# EAGLE board TP-34 (EAGLE 6.6.0), part 1 of 2
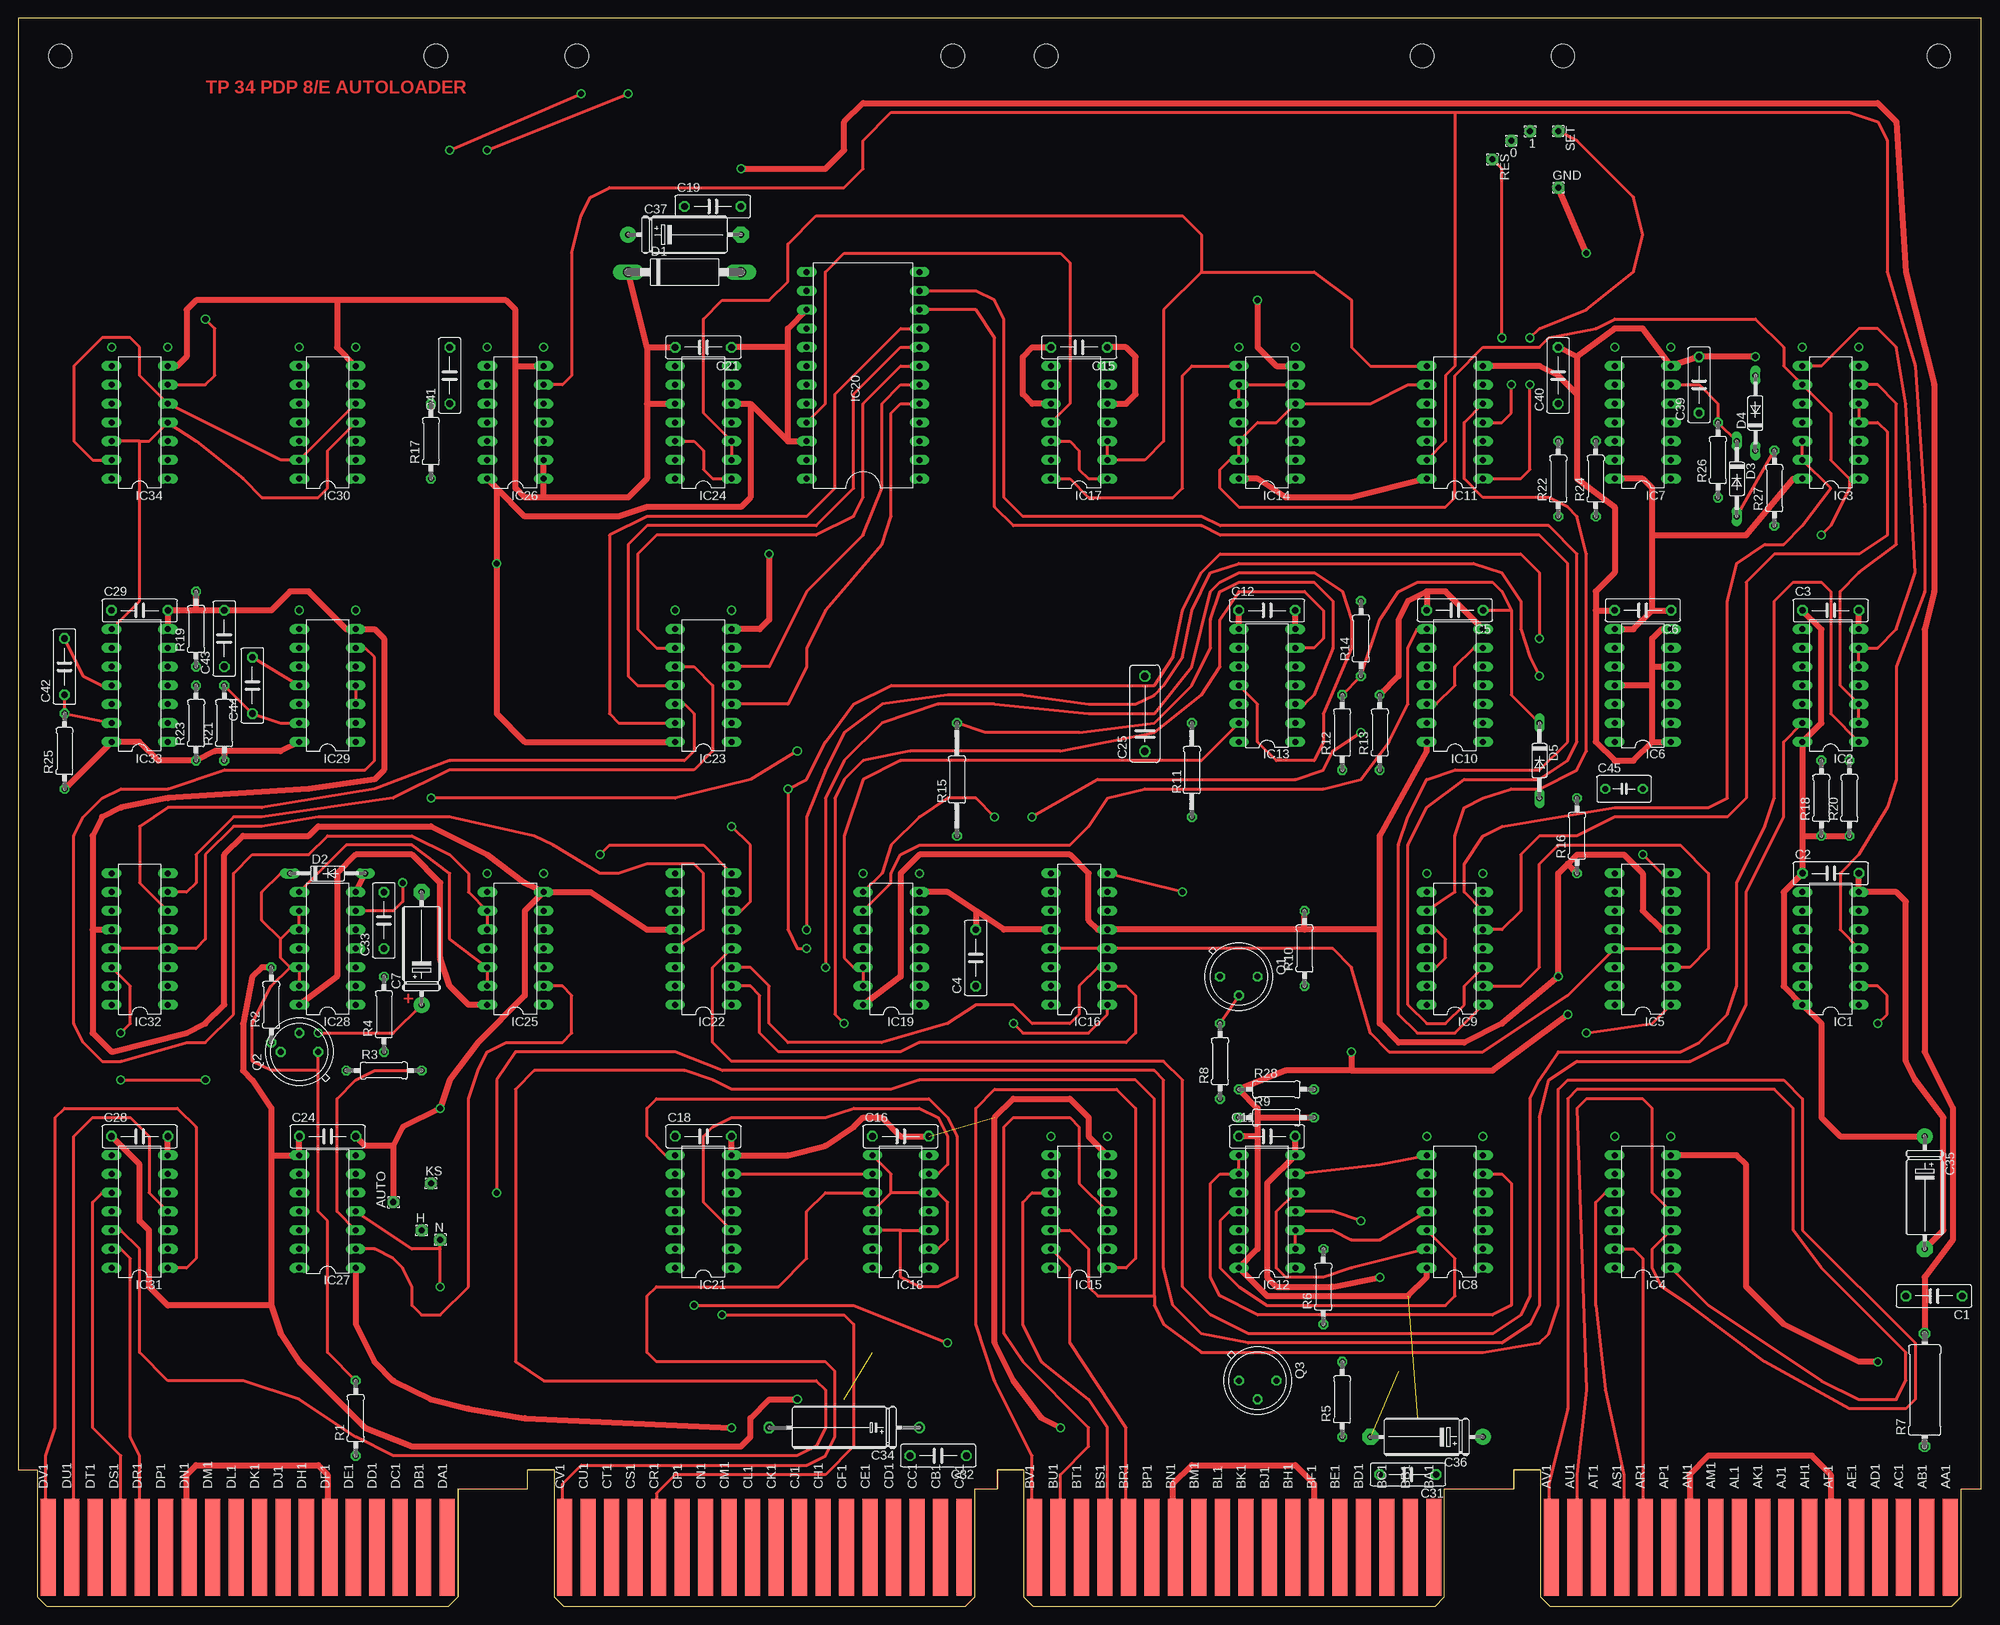
[diagram p4: board, top side]
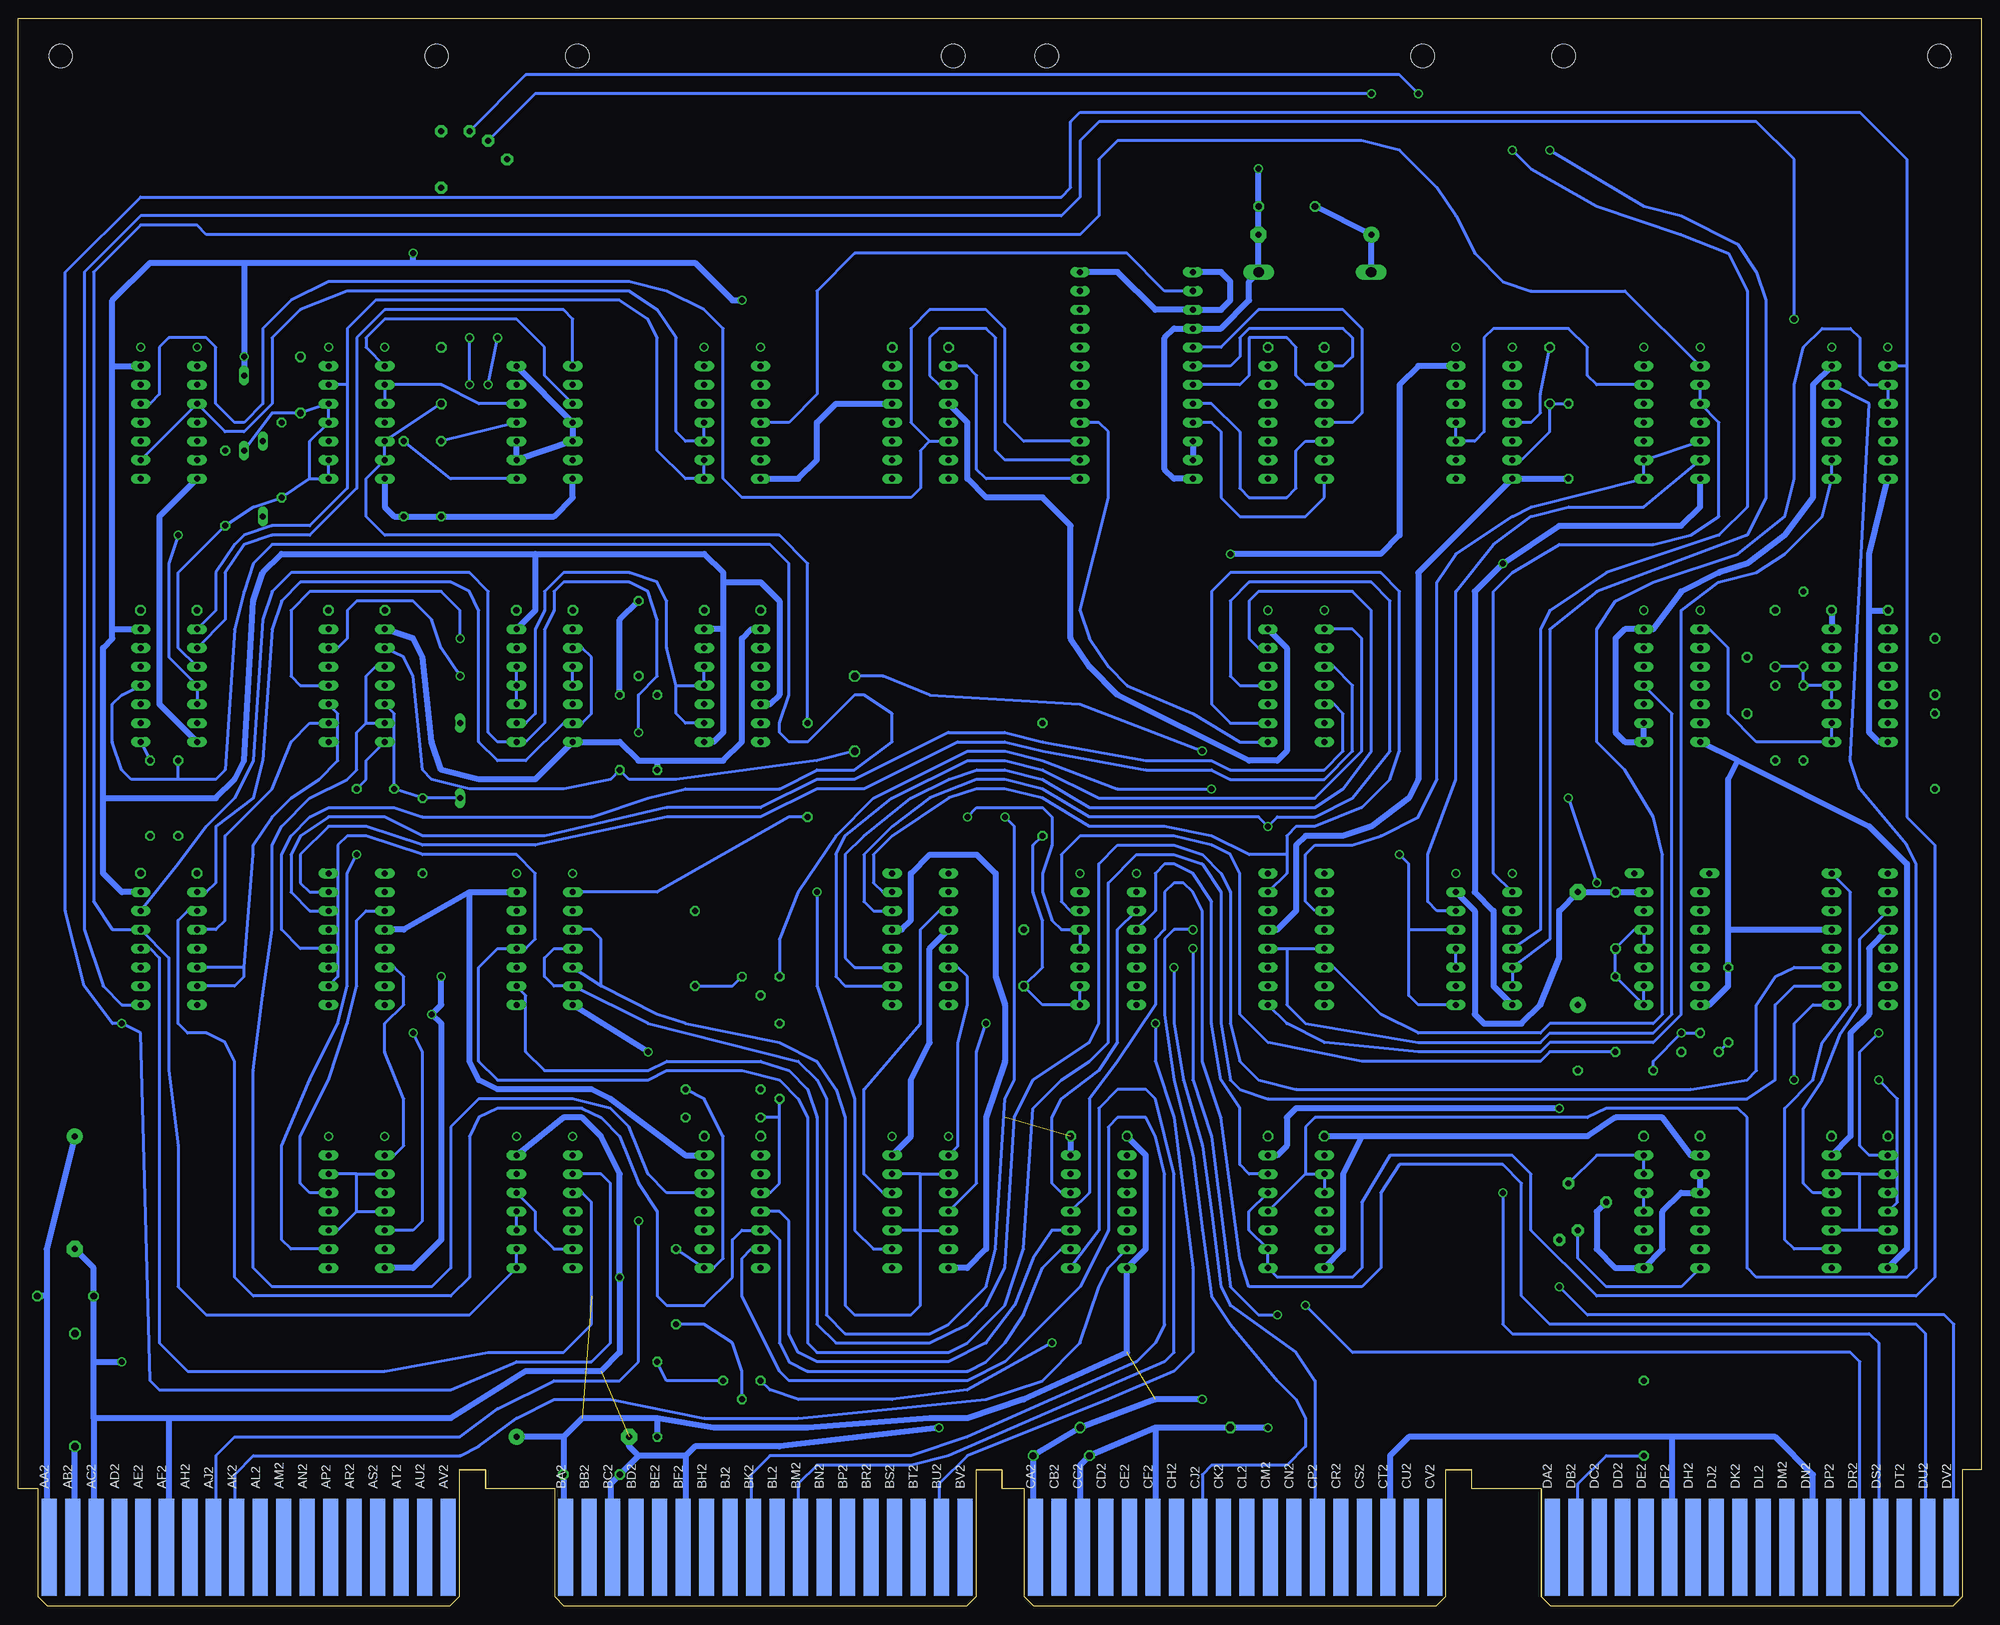
[diagram p5: board, bottom side, seen from below]

Size 265.3 x 214.63 mm. Coordinates in mm from the lower left corner, seen from the top.
Copper layers (1+16): Top 0.035mm / dielectric 1.5mm / Bottom 0.035mm
Design rules "16mils": minimum track width 16mil, minimum drill 32mil, track to track 15mil, track to pad 10mil, pad to pad 10mil, via to via 10mil, smd to smd 10mil, copper to edge 13mil, drill to drill 10mil, minimum pad ring 10mil, minimum via ring 8mil, stop-mask expansion 0mil, vias tented up to drill 0mil, thermal gap 10mil
Net classes: 1 supply: width 0.813 mm

## Footprints (pad centres in the part's own frame; a part is rotated, then mirrored left to right if it is on the bottom)
1,6/0,8 = drill 0.813 pad 1.6 octagon: 1 0,0
C075-032X103 = drill 0.914 octagon: 1 -3.81,0; 2 3.81,0
E15-5 = drill 0.813 pad 2.159: + -7.62,0 | drill 0.813 pad 2.159 octagon: - 7.62,0
C102-043X133 = drill 1.016 octagon: 1 -5.08,0; 2 5.08,0
E12-8 = drill 1.016: + -10.16,0 | drill 1.016 octagon: - 10.16,0
C050-035X075 = drill 0.813 octagon: 1 -2.54,0; 2 2.54,0
C1702-15 = drill 1.397 long: A 7.62,0; C -7.62,0
DO35-10 = drill 0.813 long: A 5.08,0; C -5.08,0
DIL14 = drill 0.813 long: 1 -7.62,-3.81; 2 -5.08,-3.81; 3 -2.54,-3.81; 4 0,-3.81; 5 2.54,-3.81; 6 5.08,-3.81; 7 7.62,-3.81; 8 7.62,3.81; 9 5.08,3.81; 10 2.54,3.81; 11 0,3.81; 12 -2.54,3.81; 13 -5.08,3.81; 14 -7.62,3.81
DIL16 = drill 0.813 long: 1 -8.89,-3.81; 2 -6.35,-3.81; 3 -3.81,-3.81; 4 -1.27,-3.81; 5 1.27,-3.81; 6 3.81,-3.81; 7 6.35,-3.81; 8 8.89,-3.81; 9 8.89,3.81; 10 6.35,3.81; 11 3.81,3.81; 12 1.27,3.81; 13 -1.27,3.81; 14 -3.81,3.81; 15 -6.35,3.81; 16 -8.89,3.81
DIL24 = drill 0.813 long: 1 -12.7,-7.62; 2 -10.16,-7.62; 3 -7.62,-7.62; 4 -5.08,-7.62; 5 -2.54,-7.62; 6 0,-7.62; 7 2.54,-7.62; 8 5.08,-7.62; 9 7.62,-7.62; 10 10.16,-7.62; 11 12.7,-7.62; 12 15.24,-7.62; 13 15.24,7.62; 14 12.7,7.62; 15 10.16,7.62; 16 7.62,7.62; 17 5.08,7.62; 18 2.54,7.62; 19 0,7.62; 20 -2.54,7.62; 21 -5.08,7.62; 22 -7.62,7.62; 23 -10.16,7.62; 24 -12.7,7.62
TO5 = drill 0.813 octagon: 1 0,-2.54; 2 2.54,0; 3 0,2.54
0207/10 = drill 0.813 octagon: 1 -5.08,0; 2 5.08,0
0414/15 = drill 1.016 octagon: 1 -7.62,0; 2 7.62,0
0207/12 = drill 0.813 octagon: 1 -6.35,0; 2 6.35,0
0207/15 = drill 0.813 octagon: 1 -7.62,0; 2 7.62,0
OMNIBUS = hole 3.175: 208.915,209.55; 259.715,209.55; 189.865,209.55; 139.065,209.55; 75.616,209.55; 126.416,209.55; 56.566,209.55; 5.766,209.55
EDGE-CON8 = smd 2.032 x 13.106: AA1 261.303,7.938; AB1 258.127,7.938; AC1 254.952,7.938; AD1 251.778,7.938; AE1 248.602,7.938; AF1 245.428,7.938; AH1 242.252,7.938; AJ1 239.077,7.938; AK1 235.903,7.938; AL1 232.727,7.938; AM1 229.553,7.938; AN1 226.377,7.938; AP1 223.202,7.938; AR1 220.028,7.938; AS1 216.852,7.938; AT1 213.678,7.938; AU1 210.502,7.938; AV1 207.327,7.938; BA1 191.452,7.938; BB1 188.278,7.938; BC1 185.102,7.938; BD1 181.928,7.938; BE1 178.752,7.938; BF1 175.577,7.938; BH1 172.403,7.938; BJ1 169.227,7.938; BK1 166.053,7.938; BL1 162.877,7.938; BM1 159.702,7.938; BN1 156.528,7.938; BP1 153.352,7.938; BR1 150.178,7.938; BS1 147.002,7.938; BT1 143.827,7.938; BU1 140.653,7.938; BV1 137.477,7.938; CA1 127.953,7.938; CB1 124.778,7.938; CC1 121.603,7.938; CD1 118.427,7.938; CE1 115.252,7.938; CF1 112.078,7.938; CH1 108.903,7.938; CJ1 105.728,7.938; CK1 102.552,7.938; CL1 99.377,7.938; CM1 96.203,7.938; CN1 93.028,7.938; CP1 89.853,7.938; CR1 86.677,7.938; CS1 83.502,7.938; CT1 80.328,7.938; CU1 77.153,7.938; CV1 73.978,7.938; DA1 58.102,7.938; DB1 54.928,7.938; DC1 51.752,7.938; DD1 48.578,7.938; DE1 45.403,7.938; DF1 42.227,7.938; DH1 39.053,7.938; DJ1 35.877,7.938; DK1 32.703,7.938; DL1 29.527,7.938; DM1 26.352,7.938; DN1 23.177,7.938; DP1 20.003,7.938; DR1 16.828,7.938; DS1 13.652,7.938; DT1 10.477,7.938; DU1 7.303,7.938; DV1 4.128,7.938 | smd 2.032 x 13.106 bottom: AA2 261.303,7.938; AB2 258.127,7.938; AC2 254.952,7.938; AD2 251.778,7.938; AE2 248.602,7.938; AF2 245.428,7.938; AH2 242.252,7.938; AJ2 239.077,7.938; AK2 235.903,7.938; AL2 232.727,7.938; AM2 229.553,7.938; AN2 226.377,7.938; AP2 223.202,7.938; AR2 220.028,7.938; AS2 216.852,7.938; AT2 213.678,7.938; AU2 210.502,7.938; AV2 207.327,7.938; BA2 191.452,7.938; BB2 188.278,7.938; BC2 185.102,7.938; BD2 181.928,7.938; BE2 178.752,7.938; BF2 175.577,7.938; BH2 172.403,7.938; BJ2 169.227,7.938; BK2 166.053,7.938; BL2 162.877,7.938; BM2 159.702,7.938; BN2 156.528,7.938; BP2 153.352,7.938; BR2 150.178,7.938; BS2 147.002,7.938; BT2 143.827,7.938; BU2 140.653,7.938; BV2 137.477,7.938; CA2 127.953,7.938; CB2 124.778,7.938; CC2 121.603,7.938; CD2 118.427,7.938; CE2 115.252,7.938; CF2 112.078,7.938; CH2 108.903,7.938; CJ2 105.728,7.938; CK2 102.552,7.938; CL2 99.377,7.938; CM2 96.203,7.938; CN2 93.028,7.938; CP2 89.853,7.938; CR2 86.677,7.938; CS2 83.502,7.938; CT2 80.328,7.938; CU2 77.153,7.938; CV2 73.978,7.938; DA2 58.102,7.938; DB2 54.928,7.938; DC2 51.752,7.938; DD2 48.578,7.938; DE2 45.403,7.938; DF2 42.227,7.938; DH2 39.053,7.938; DJ2 35.877,7.938; DK2 32.703,7.938; DL2 29.527,7.938; DM2 26.352,7.938; DN2 23.177,7.938; DP2 20.003,7.938; DR2 16.828,7.938; DS2 13.652,7.938; DT2 10.477,7.938; DU2 7.303,7.938; DV2 4.128,7.938

## Placement (x,y rotation side)
0  [1,6/0,8]  201.8,198.12 180 top
1  [1,6/0,8]  204.34,199.39 180 top
AUTO  [1,6/0,8]  50.67,54.61 90 top
C1  .01uF  [C075-032X103]  258.95,41.91 180 top
C2  .01uF  [C075-032X103]  244.98,99.06 0 top
C3  .01uF  [C075-032X103]  244.98,134.62 0 top
C4  .22uF  [C075-032X103]  129.41,87.63 90 top
C5  .01uF  [C075-032X103]  194.18,134.62 180 top
C6  .01uF  [C075-032X103]  219.58,134.62 180 top
C7  39uF (not installed)  [E15-5]  54.48,88.9 90 top
C11  .01uF  [C075-032X103]  168.78,63.5 0 top
C12  .01uF  [C075-032X103]  168.78,134.62 0 top
C15  .01uF  [C075-032X103]  143.38,170.18 180 top
C16  .01uF  [C075-032X103]  119.25,63.5 0 top
C18  .01uF  [C075-032X103]  92.58,63.5 0 top
C19  .01uF  [C075-032X103]  93.85,189.23 0 top
C21  .01uF  [C075-032X103]  92.58,170.18 180 top
C24  .01uF  [C075-032X103]  41.78,63.5 0 top
C25  56pF  [C102-043X133]  152.27,120.65 90 top
C28  .01uF  [C075-032X103]  16.38,63.5 0 top
C29  .01uF  [C075-032X103]  16.38,134.62 0 top
C31  .01uF  [C075-032X103]  187.83,17.78 180 top
C32  .01uF  [C075-032X103]  124.33,20.32 180 top
C33  .01uF  [C075-032X103]  49.4,92.71 90 top
C34  22uF  [E12-8]  111.63,24.13 180 top
C35  25uF  [E15-5]  257.68,55.88 270 top
C36  25uF  [E15-5]  190.37,22.86 180 top
C37  25uF  [E15-5]  90.04,185.42 0 top
C39  .22uF  [C075-032X103]  227.2,165.1 90 top
C40  .01uF  [C075-032X103]  208.15,166.37 90 top
C41  1nF  [C075-032X103]  58.29,166.37 90 top
C42  1nF  [C075-032X103]  6.22,127 90 top
C43  .01uF  [C075-032X103]  27.81,130.81 90 top
C44  1nF  [C075-032X103]  31.62,124.46 90 top
C45  1nF  [C050-035X075]  217.04,110.49 0 top
D1  10V 1N4739  [C1702-15]  90.04,180.34 0 top
D2  1N4154  [DO35-10]  41.78,99.06 0 top
D3  1N4154  [DO35-10]  232.28,152.4 270 top
D4  1N4154  [DO35-10]  234.82,161.29 90 top
D5  1N4154  [DO35-10]  205.61,114.3 270 top
GND  [1,6/0,8]  208.15,191.77 0 top
H  [1,6/0,8]  54.48,50.8 0 top
IC1  7420N  [DIL14]  244.98,88.9 90 top
IC2  7401N  [DIL14]  244.98,124.46 90 top
IC3  7420N  [DIL14]  244.98,160.02 90 top
IC4  7401N  [DIL14]  219.58,53.34 90 top
IC5  7475N  [DIL16]  219.58,90.17 90 top
IC6  SP380N  [DIL14]  219.58,124.46 90 top
IC7  7413N  [DIL14]  219.58,160.02 90 top
IC8  7400N  [DIL14]  194.18,53.34 90 top
IC9  7404N  [DIL14]  194.18,88.9 90 top
IC10  7400N  [DIL14]  194.18,124.46 90 top
IC11  7474N  [DIL14]  194.18,160.02 90 top
IC12  7401N  [DIL14]  168.78,53.34 90 top
IC13  SP384N  [DIL14]  168.78,124.46 90 top
IC14  7400N  [DIL14]  168.78,160.02 90 top
IC15  7401N  [DIL14]  143.38,53.34 90 top
IC16  7475N  [DIL16]  143.38,90.17 90 top
IC17  7493N  [DIL14]  143.38,160.02 90 top
IC18  7401N  [DIL14]  119.25,53.34 90 top
IC19  7413N  [DIL14]  117.98,88.9 90 top
IC20  AM1702A  [DIL24]  114.17,165.1 90 top
IC21  7400N  [DIL14]  92.58,53.34 90 top
IC22  7475N  [DIL16]  92.58,90.17 90 top
IC23  7404N  [DIL14]  92.58,124.46 90 top
IC24  7493N  [DIL14]  92.58,160.02 90 top
IC25  7400N  [DIL14]  67.18,88.9 90 top
IC26  74122N  [DIL14]  67.18,160.02 90 top
IC27  SP380N  [DIL14]  41.78,53.34 90 top
IC28  7413N  [DIL14]  41.78,88.9 90 top
IC29  74122N  [DIL14]  41.78,124.46 90 top
IC30  7420N  [DIL14]  41.78,160.02 90 top
IC31  7401N  [DIL14]  16.38,53.34 90 top
IC32  7475N  [DIL16]  16.38,90.17 90 top
IC33  74122N  [DIL14]  16.38,124.46 90 top
IC34  7420N  [DIL14]  16.38,160.02 90 top
KS  [1,6/0,8]  55.75,57.15 0 top
N  [1,6/0,8]  57.02,49.53 0 top
Q1  2N3646  [TO5]  164.97,85.09 270 top
Q2  2N3646  [TO5]  37.97,74.93 90 top
Q3  2N3646  [TO5]  167.51,30.48 270 top
R1  3.9K  [0207/10]  45.59,25.4 90 top
R2  51  [0207/10]  34.16,81.28 90 top
R3  1K  [0207/10]  49.4,72.39 0 top
R4  150  [0207/10]  49.4,80.01 90 top
R5  27  [0207/10]  178.94,27.94 90 top
R6  27  [0207/10]  176.4,43.18 90 top
R7  120 2W  [0414/15]  257.68,29.21 90 top
R8  27  [0207/10]  162.43,73.66 90 top
R9  470  [0207/10]  170.05,66.04 0 top
R10  27  [0207/10]  173.86,88.9 90 top
R11  270  [0207/12]  158.62,113.03 90 top
R12  220  [0207/10]  178.94,118.11 90 top
R13  6.8K  [0207/10]  184.02,118.11 90 top
R14  680  [0207/10]  181.48,130.81 90 top
R15  220  [0207/15]  126.87,111.76 90 top
R16  1.8K  [0207/10]  210.69,104.14 90 top
R17  33K  [0207/10]  55.75,157.48 90 top
R18  1K  [0207/10]  243.71,109.22 90 top
R19  680  [0207/10]  24,132.08 90 top
R20  1K  [0207/10]  247.52,109.22 90 top
R21  33K  [0207/10]  27.81,119.38 90 top
R22  680  [0207/10]  208.15,152.4 90 top
R23  220  [0207/10]  24,119.38 90 top
R24  680  [0207/10]  213.23,152.4 90 top
R25  33K  [0207/10]  6.22,115.57 90 top
R26  390  [0207/10]  229.74,154.94 90 top
R27  120  [0207/10]  237.36,151.13 90 top
R28  470  [0207/10]  170.05,69.85 0 top
RES  [1,6/0,8]  199.26,195.58 270 top
SET  [1,6/0,8]  208.15,199.39 270 top
U$1  OUTLINE-OMNIBUS  [OMNIBUS]  -0.13,0 0 top
U$2  [EDGE-CON8]  -0.13,0 0 top